# EAGLE design ftdi_modbus_v2 (EAGLE 6.2)
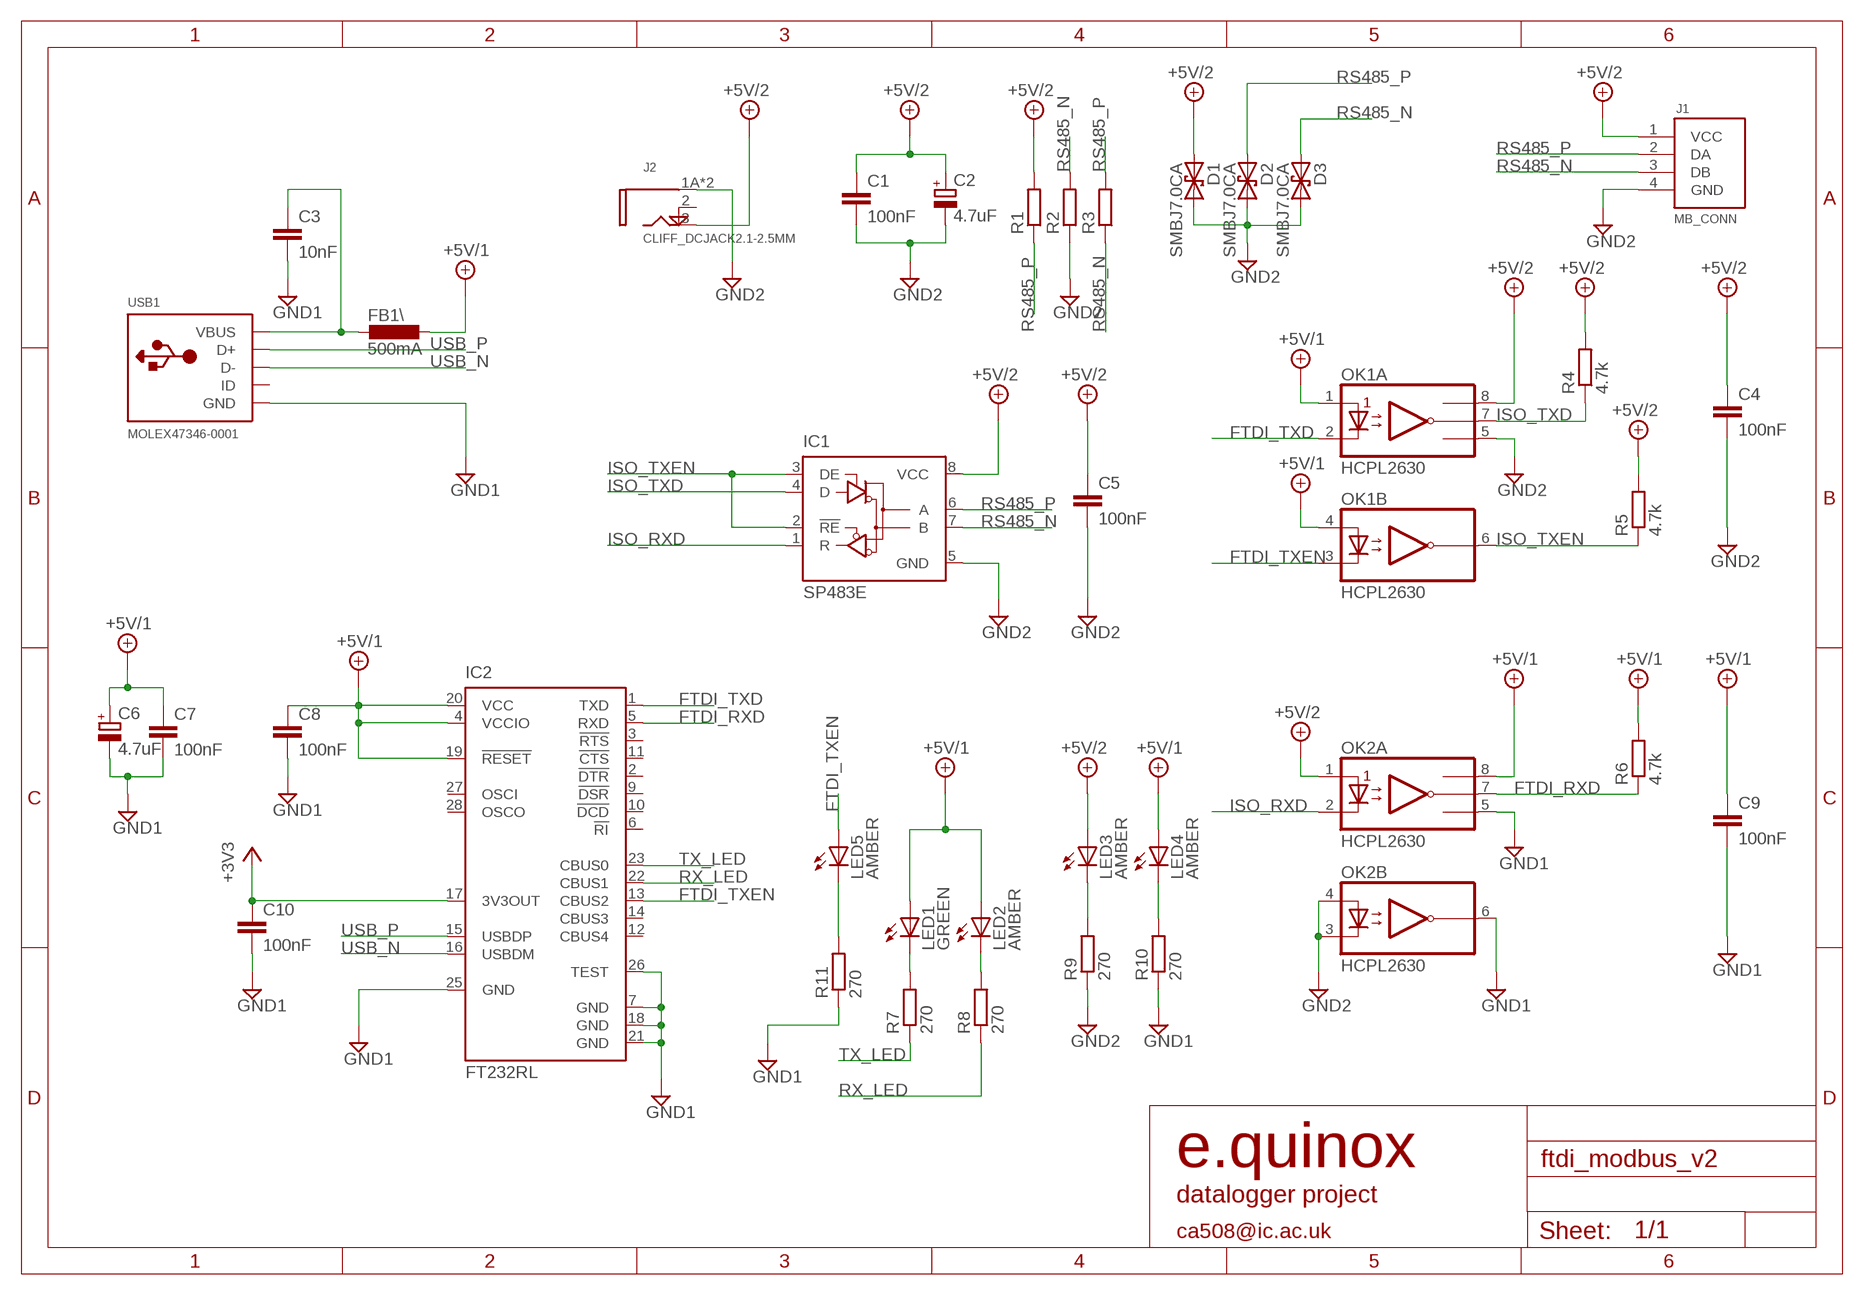
[diagram p0: schematic, sheet 1]

## Parts
C1  100nF  C-EUC0603  [C0603]
C2  4.7uF  CPOL-EUB/3528-21R  [B/3528-21R]
C3  10nF  C-EUC0603  [C0603]
C4  100nF  C-EUC1206  [C1206]
C5  100nF  C-EUC0603  [C0603]
C6  4.7uF  CPOL-EUB/3528-21R  [B/3528-21R]
C7  100nF  C-EUC0603  [C0603]
C8  100nF  C-EUC0603  [C0603]
C9  100nF  C-EUC1206  [C1206]
C10  100nF  C-EUC0603  [C0603]
D1  SMBJ7.0CA  [DO214AA]
D2  SMBJ7.0CA  [DO214AA]
D3  SMBJ7.0CA  [DO214AA]
FB1\  500mA  L-EUL3216C  [L3216C]
IC1  SP483E  75176AD  [D_R-PDSO-G8]
IC2  FT232RL  [SSOP28]
J1  MB_CONN  [PTSM0,5/4-HH-2,5-THR]
J2  CLIFF_DCJACK2.1-2.5MM  [FC6814XS]
LED1  GREEN  LEDCHIPLED_0805  [CHIPLED_0805]
LED2  AMBER  LEDCHIPLED_0805  [CHIPLED_0805]
LED3  AMBER  LEDCHIPLED_0805  [CHIPLED_0805]
LED4  AMBER  LEDCHIPLED_0805  [CHIPLED_0805]
LED5  AMBER  LEDCHIPLED_0805  [CHIPLED_0805]
OK1  HCPL2630  [DIL08]
OK2  HCPL2630  [DIL08]
R1  R-EU_0207/10  [0207/10]
R2  R-EU_0207/10  [0207/10]
R3  R-EU_0207/10  [0207/10]
R4  4.7k  R-EU_M0805  [M0805]
R5  4.7k  R-EU_M0805  [M0805]
R6  4.7k  R-EU_M0805  [M0805]
R7  270  R-EU_M0805  [M0805]
R8  270  R-EU_M0805  [M0805]
R9  270  R-EU_M0805  [M0805]
R10  270  R-EU_M0805  [M0805]
R11  270  R-EU_M0805  [M0805]
USB1  MOLEX47346-0001  [47346-0001]

## Nets
+3V3: C10.1 IC2.17(3V3OUT)
+5V/1: C6.+ C7.1 C8.1 C9.1 FB1\.1 IC2.4(VCCIO) IC2.19(!RESET) IC2.20(VCC) LED1.A LED2.A LED4.A OK1.1(A:A1) OK1.4(B:A2) OK2.8(A:VCC) R6.2
+5V/2: C1.1 C2.+ C4.1 C5.1 D1.P$1 IC1.8(VCC) J1.1(VCC) J2.3(TIP) LED3.A OK1.8(A:VCC) OK2.1(A:A1) R1.2 R4.2 R5.2
FTDI_RXD: IC2.5(RXD) OK2.7(A:VO1) R6.1
FTDI_TXD: IC2.1(TXD) OK1.2(A:C1)
FTDI_TXEN: IC2.13(CBUS2) LED5.A OK1.3(B:C2)
GND1: C3.2 C6.- C7.2 C8.2 C9.2 C10.2 IC2.7(GND) IC2.18(GND) IC2.21(GND) IC2.25(GND) IC2.26(TEST) OK2.5(A:GND) OK2.6(B:VO2) R10.1 R11.1 USB1.5(GND)
GND2: C1.2 C2.- C4.2 C5.2 D1.P$2 D2.P$2 D3.P$2 IC1.5(GND) J1.4(GND) J2.1A(SLEEVE) J2.1B(SLEEVE) OK1.5(A:GND) OK2.3(B:C2) OK2.4(B:A2) R2.1 R9.1
ISO_RXD: IC1.1(R) OK2.2(A:C1)
ISO_TXD: IC1.4(D) OK1.7(A:VO1) R4.1
ISO_TXEN: IC1.2(!RE) IC1.3(DE) OK1.6(B:VO2) R5.1
N$1: C3.1 FB1\.2 USB1.1(VBUS)
N$3: LED1.C R7.2
N$4: LED2.C R8.2
N$7: LED3.C R9.2
N$8: LED4.C R10.2
N$9: LED5.C R11.2
RS485_N: D3.P$1 IC1.7(B) J1.3(DB) R2.2 R3.1
RS485_P: D2.P$1 IC1.6(A) J1.2(DA) R1.1 R3.2
RX_LED: IC2.22(CBUS1) R8.1
TX_LED: IC2.23(CBUS0) R7.1
USB_N: IC2.16(USBDM) USB1.2(D-)
USB_P: IC2.15(USBDP) USB1.3(D+)
Unconnected: IC2.2(!DTR) IC2.3(!RTS) IC2.6(!RI) IC2.9(!DSR) IC2.10(!DCD) IC2.11(!CTS) IC2.12(CBUS4) IC2.14(CBUS3) IC2.27(OSCI) IC2.28(OSCO) USB1.4(ID)

## Notes on the sheet
- e.quinox
- datalogger project
- ca508@ic.ac.uk

## Power pins joined to a net without a drawn wire
SHUNT: J2.2(SHUNT)

## Library data of the parts
C1 C3-C5 C7-C10 = resistor:C-EU: CAPACITOR, European symbol
C2 C6 = resistor:CPOL-EU: POLARIZED CAPACITOR, European symbol
D1-D3 = eko-parts:SMBJ7.0CA
FB1\ = resistor:L-EU: INDUCTOR, European symbol
IC1 = 751xx:75176A: DIFFERENTIAL BUS TRANSCEIVER Source: http://focus.ti.com/lit/ds/symlink/sn75176a.pdf
IC2 = ftdichip:FT232R: Source: http://www.ftdichip.com/Documents/DataSheets/DS_FT232R_v104.pdf; MPN: FT232RL; OC_FARNELL: 1146032; OC_NEWARK: 91K9918
J1 = connectors-pheonix:MB_CONN: Datasheet: Link <http://docs-europe.electrocomponents.com/webdocs/0ecc/0900766b80ecc30f.pdf> RS Stock No:712-4500 <http://uk.rs-online.com/web/p/terminal-blocks/7124500/> Mfr Part: PTSM 0,5/ 4-HH-2,5-THR
J2 = minibox-parts:CLIFF_DCJACK
LED1-LED5 = led:LED: LED OSRAM: - CHIPLED LG R971, LG N971, LY N971, LG Q971, LY Q971, LO R971, LY R971 LH N974, LH R974 LS Q976, LO Q976, LY Q976 LO Q996 - Hyper CHIPLED LW Q18S LB Q993, LB Q99A, LB R99A - SideLED LS A670, LO A670, LY A670, LG A670, LP A670 LB A673, LV A673, LT A673, LW A673 LH A674 LY A675 LS A676, LA A676, LO A676, LY A676, LW A676 LS A679, LY A679, LG A679 - Hyper Micro SIDELED® LS Y876, LA Y876, LO Y876, LY Y876 LT Y87S - SmartLED LW L88C, LW L88S LB L89C, LB L89S, LG L890 LS L89K, LO L89K, LY L89K LS L896, LA L896, LO L896, LY L896 - TOPLED LS T670, LO T670, LY T670, LG T670, LP T670 LSG T670, LSP T670, LSY T670, LOP T670, LYG T670 LG T671, LOG T671, LSG T671 LB T673, LV T673, LT T673, LW T673 LH T674 LS T676, LA T676, LO T676, LY T676, LB T676, LH T676, LSB T676, LW T676 LB T67C, LV T67C, LT T67C, LS T67K, LO T67K, LY T67K, LW E67C LS E67B, LA E67B, LO E67B, LY E67B, LB E67C, LV E67C, LT E67C LW T67C LS T679, LY T679, LG T679 LS T770, LO T770, LY T770, LG T770, LP T770 LB T773, LV T773, LT T773, LW T773 LH T774 LS E675, LA E675, LY E675, LS T675 LS T776, LA T776, LO T776, LY T776, LB T776 LHGB T686 LT T68C, LB T68C - Hyper Mini TOPLED® LB M676 - Mini TOPLED Santana® LG M470 LS M47K, LO M47K, LY M47K Source: http://www.osram.convergy.de LUXEON: - LUMILED® LXK2-PW12-R00, LXK2-PW12-S00, LXK2-PW14-U00, LXK2-PW14-V00 LXK2-PM12-R00, LXK2-PM12-S00, LXK2-PM14-U00 LXK2-PE12-Q00, LXK2-PE12-R00, LXK2-PE12-S00, LXK2-PE14-T00, LXK2-PE14-U00 LXK2-PB12-K00, LXK2-PB12-L00, LXK2-PB12-M00, LXK2-PB14-N00, LXK2-PB14-P00, LXK2-PB14-Q00 LXK2-PR12-L00, LXK2-PR12-M00, LXK2-PR14-Q00, LXK2-PR14-R00 LXK2-PD12-Q00, LXK2-PD12-R00, LXK2-PD12-S00 LXK2-PH12-R00, LXK2-PH12-S00 LXK2-PL12-P00, LXK2-PL12-Q00, LXK2-PL12-R00 Source: www.luxeon.com KINGBRIGHT: KA-3528ASYC Source: www.kingbright.com
OK1 OK2 = optocoupler:HCPL2630: HEWLETT PACKARD OPTO COUPLER; MF: AGILENT TECHNOLOGIES; MPN: HCPL-2630-000E; OC_FARNELL: 9994904; OC_NEWARK: 88H7813
R1-R11 = resistor:R-EU_: RESISTOR, European symbol
USB1 = connectors-usb-ca508fyp:MOLEX47346-0001: USB Micro B http://onecall.farnell.com/jsp/search/browse.jsp;jsessionid=IUXOLF3HYHDEGCQLCIPJOXQ?N=411&Ntk=gensearch&Ntt=47346-0001&Ntx=mode+matchallpartial&exposeLevel2Refinement=true&suggestions=false&ref=globalsearch&_requestid=528981

## Board
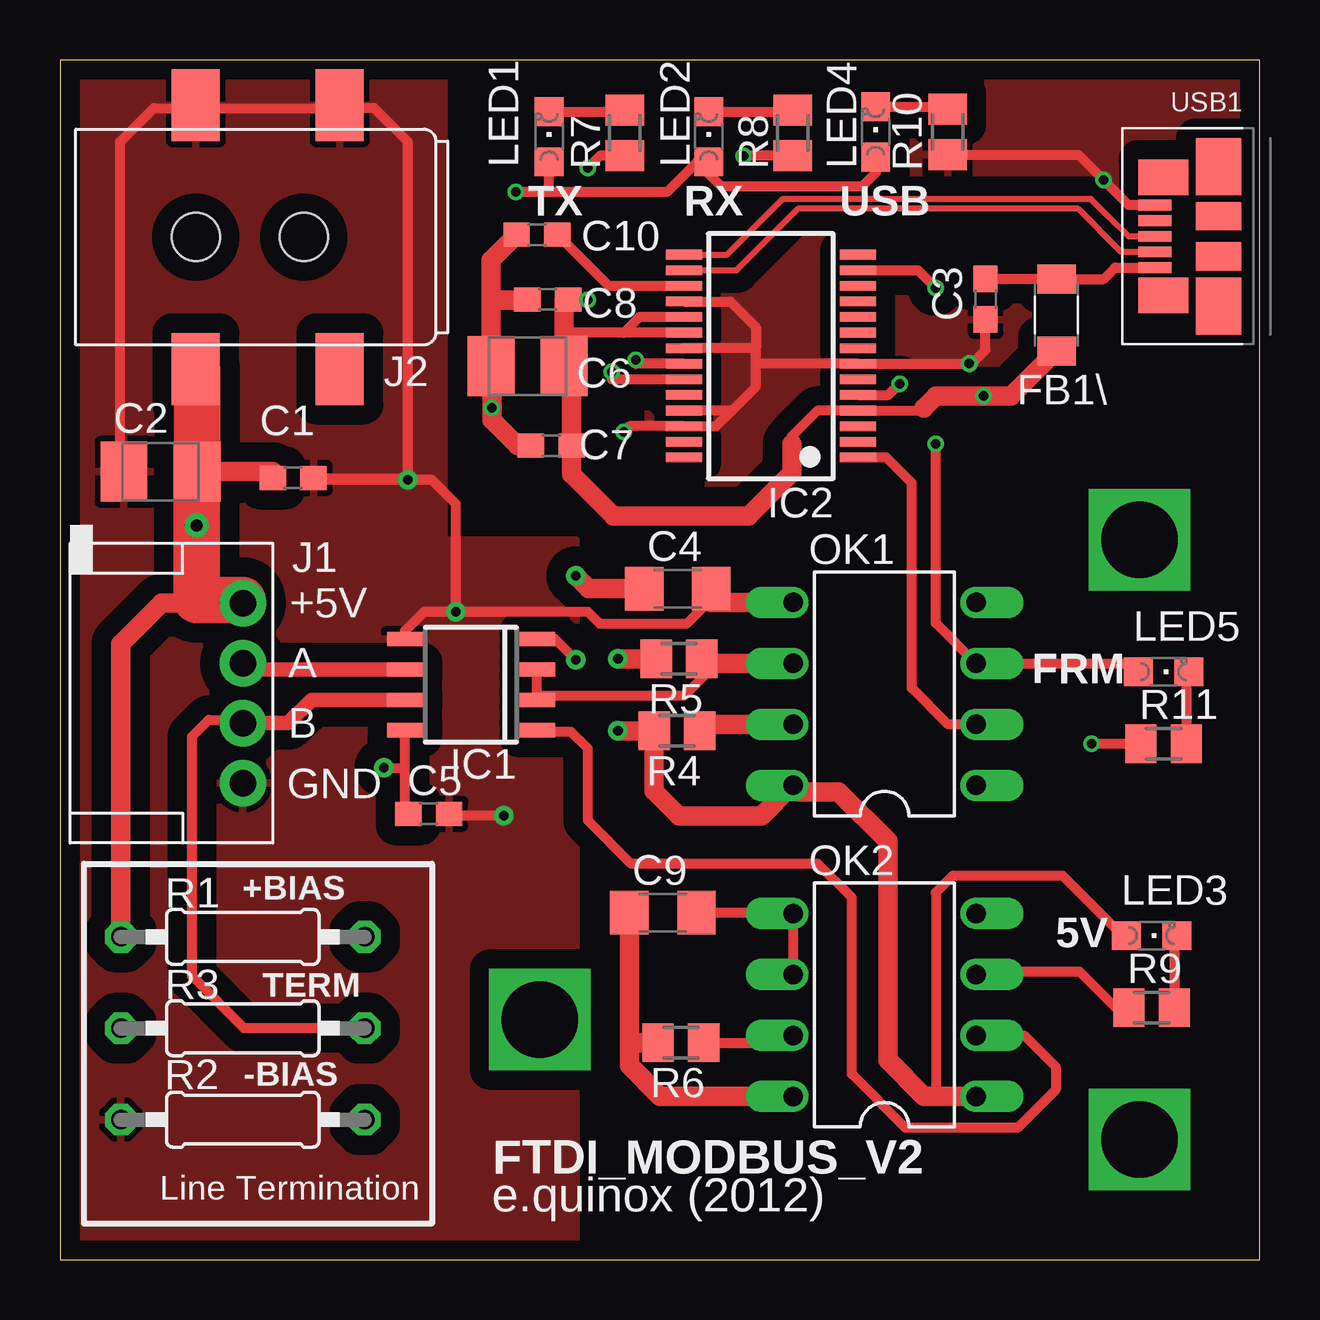
[diagram p1: board, top side]
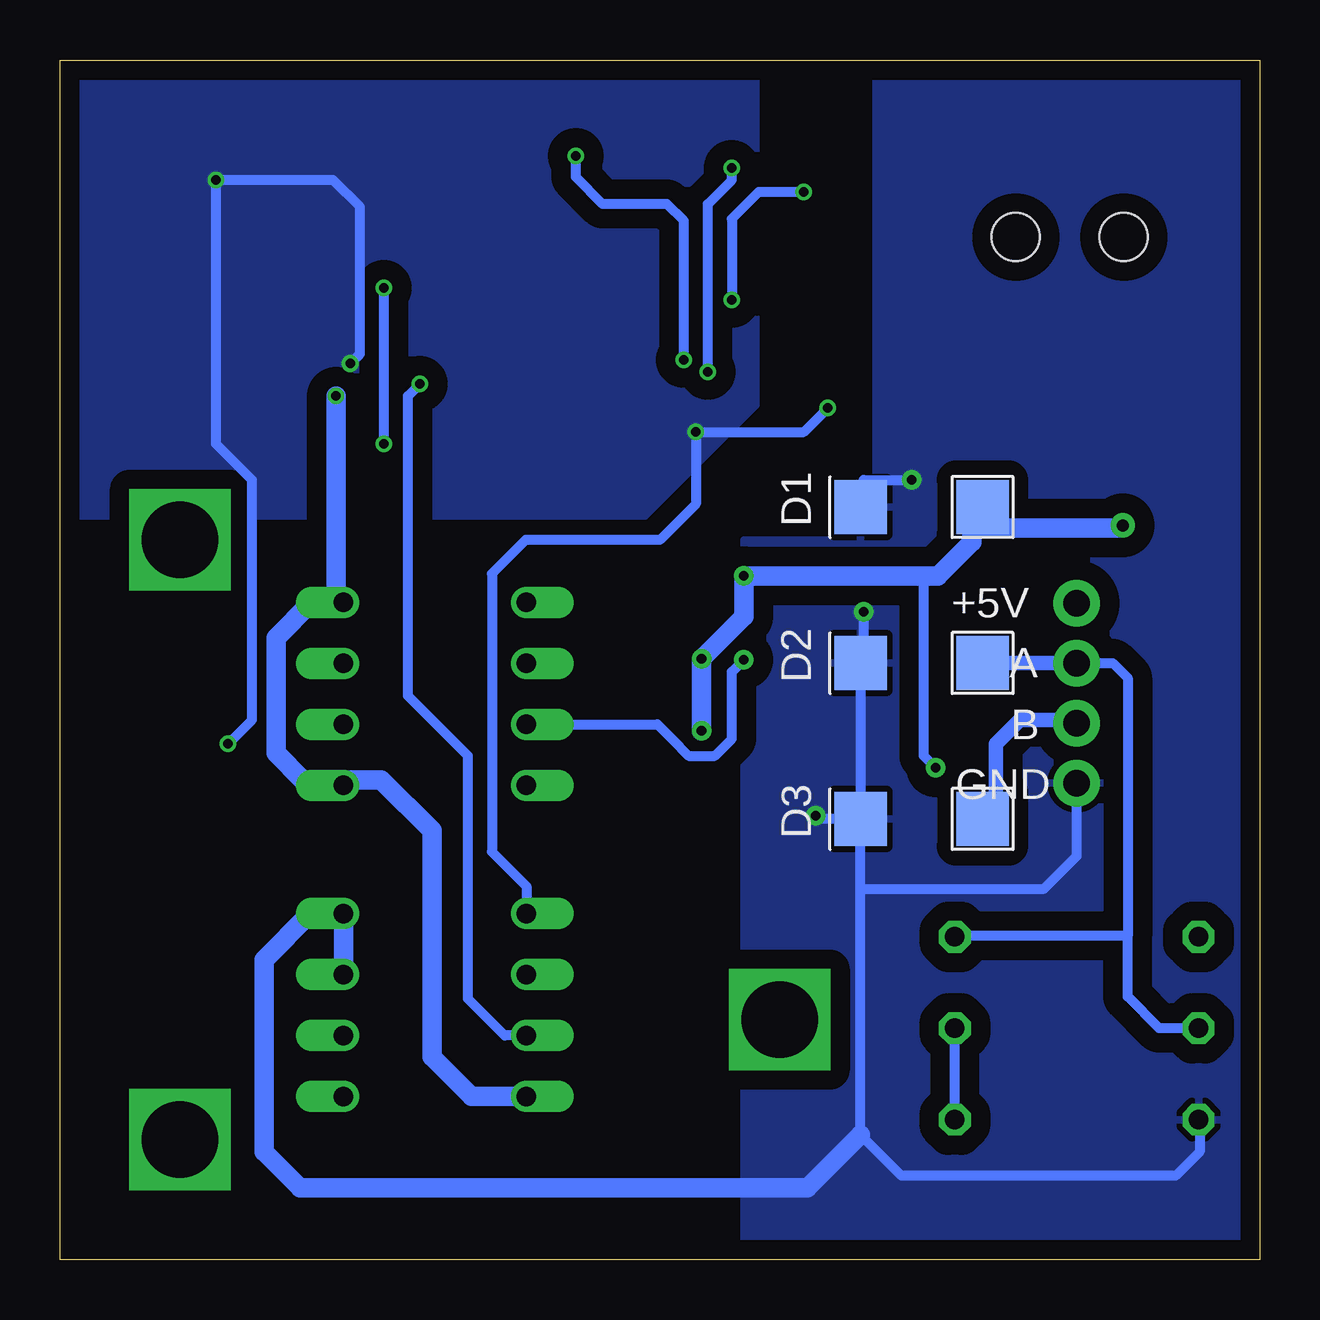
[diagram p2: board, bottom side, seen from below]

Size 50 x 50 mm. Coordinates in mm from the lower left corner, seen from the top.
Outline: 0,0 50,0 50,50 0,50 0,0
Copper layers (1*16): Top 0.035mm / dielectric 1.5mm / Bottom 0.035mm
Design rules: minimum track width 6mil, minimum drill 12mil, track to track 6mil, track to pad 6mil, pad to pad 6mil, via to via 6mil, smd to smd 0mil, copper to edge 10mil, drill to drill 10mil, minimum pad ring 10mil, minimum via ring 6mil, stop-mask expansion 2mil, vias tented up to drill 100mil, thermal gap 10mil

### Footprints (pad centres in the part's own frame; a part is rotated, then mirrored left to right if it is on the bottom)
C0603 = smd 1.1 x 1: 1 -0.85,0; 2 0.85,0
B/3528-21R = smd 1.95 x 2.5: + 1.525,0; - -1.525,0
C1206 = smd 1.6 x 1.8: 1 -1.4,0; 2 1.4,0
DO214AA = smd 2.184 x 2.261: P$1 -2.54,0; P$2 2.54,0
L3216C = smd 1.2 x 1.6: 1 -1.5,0; 2 1.5,0
D_R-PDSO-G8 = smd 0.6 x 1.5: 1 -1.905,-2.75; 2 -0.635,-2.75; 3 0.635,-2.75; 4 1.905,-2.75; 5 1.905,2.75; 6 0.635,2.75; 7 -0.635,2.75; 8 -1.905,2.75
SSOP28 = smd 0.4 x 1.5: 1 -4.225,-3.625; 2 -3.575,-3.625; 3 -2.925,-3.625; 4 -2.275,-3.625; 5 -1.625,-3.625; 6 -0.975,-3.625; 7 -0.325,-3.625; 8 0.325,-3.625; 9 0.975,-3.625; 10 1.625,-3.625; 11 2.275,-3.625; 12 2.925,-3.625; 13 3.575,-3.625; 14 4.225,-3.625; 15 4.225,3.625; 16 3.575,3.625; 17 2.925,3.625; 18 2.275,3.625; 19 1.625,3.625; 20 0.975,3.625; 21 0.325,3.625; 22 -0.325,3.625; 23 -0.975,3.625; 24 -1.625,3.625; 25 -2.275,3.625; 26 -2.925,3.625; 27 -3.575,3.625; 28 -4.225,3.625
PTSM0,5/4-HH-2,5-THR = drill 1.1 pad 1.93: 1 -3.75,0; 2 -1.25,0; 3 1.25,0; 4 3.75,0
FC6814XS = smd 3 x 2: 1A -5.5,-4.5; 1B -5.5,1.5; 2 5.5,1.5; 3 5.5,-4.5 | hole 2: 0,0; 0,-4.5
CHIPLED_0805 = smd 1.2 x 1.2: A 0,-1.05; C 0,1.05
DIL08 = drill 0.813 offset: 1 -3.81,-3.81; 2 -1.27,-3.81; 3 1.27,-3.81; 4 3.81,-3.81; 5 3.81,3.81; 6 1.27,3.81; 7 -1.27,3.81; 8 -3.81,3.81
0207/10 = drill 0.813 octagon: 1 -5.08,0; 2 5.08,0
M0805 = smd 1.3 x 1.6: 1 -0.95,0; 2 0.95,0
47346-0001 = smd 1.38 x 0.45: 1 2.66,1.3; 2 2.66,0.65; 3 2.66,0; 4 2.66,-0.65; 5 2.66,-1.3 | smd 1.9 x 2.375: SHIELD-1 0,2.913; SHIELD-4 0,-2.913 | smd 1.9 x 1.175: SHIELD-2 0,0.838; SHIELD-3 0,-0.838 | smd 2.1 x 1.475: SHIELD-6 2.3,2.462; SHIELD-7 2.3,-2.462

### Placement (x,y rotation side)
C1  9.72,32.58 0 top
C2  4.19,32.84 0 top
C3  38.58,40.03 270 top
C4  25.75,27.96 0 top
C5  15.37,18.58 0 top
C6  19.49,37.23 0 top
C7  20.48,33.92 180 top
C8  20.33,40.02 180 top
C9  25.13,14.46 0 top
C10  19.88,42.72 180 top
D1  14.09,31.36 180 bottom
D2  14.09,24.86 180 bottom
D3  14.09,18.36 180 bottom
FB1\  41.54,39.37 90 top
IC1  17.13,23.96 90 top
IC2  29.63,37.66 90 top
J1  7.62,23.61 270 top
J2  10.16,42.62 270 top
LED1  20.39,46.8 0 top
LED2  27.04,46.8 0 top
LED3  45.5,13.5 270 top
LED4  34,47 0 top
LED5  46,24.5 270 top
OK1  34.37,23.58 90 top
OK2  34.37,10.61 90 top
R1  7.62,13.45 180 top
R2  7.62,5.83 0 top
R3  7.62,9.64 180 top
R4  25.72,22.04 180 top
R5  25.8,25.04 180 top
R6  25.88,9.04 180 top
R7  23.54,46.96 90 top
R8  30.54,46.96 90 top
R9  45.5,10.5 0 top
R10  37,47 90 top
R11  46,21.5 0 top
USB1  48.29,42.65 180 top

### Tracks (layer width: path | path; a pad name or v marks a point on that pad's centre or on a via)
+3V3
  Top 0.406: C10.1 22.86,40.59 IC2.17
+5V/1  (via drill 0.4 pad 0.61)
  Top 0.406: IC2.20 23.5,38.63 | 23.5,38.63 21.02,38.63 21.02,38.5 | IC2.19 24.15,39.28 23.5,38.63 | 36,35.5 36,35.38 IC2.4 31.57,35.38 30.5,34.31 30.5,34 | 20.39,44.5 25.29,44.5 26.54,45.75 LED2.A 27.04,45.26 27.58,44.72 33.43,44.72 34,45.29 LED4.A | 20.39,44.5 LED1.A | 21.02,40.02 22,40.02 v22,40 | 20.39,44.5 v19,44.5
  Top 0.813: FB1\.1 41.5,37.87 39.63,36 v38.5,36 36.5,36 36,35.5 | C8.1 21.02,40.02 21.02,38.5 C6.+ 21.33,37.23 C7.1 21.33,32.74 23.07,31 28.7,31 30.5,32.8 30.5,34 | R6.2 23.73,9.04 | 23.73,9.04 C9.1 | OK2.8 25.02,6.8 23.73,8.09 23.73,9.04
  Bottom 0.406: v19,44.5 20.88,44.5 22,43.38 v22,40
  Bottom 0.813: OK2.8 32.84,6.8 34.5,8.46 34.5,17.88 36.62,20 37.95,20 | 37.95,20 OK1.1 | 37.95,20 39.88,20 41,21.12 41,25.91 39.52,27.39 OK1.4 38.5,27.39 v38.5,36
+5V/2  (via drill 0.4 pad 0.81, 0.5 pad 1.02)
  Top 0.406: C5.1 14.38,18.58 14.38,20.5 | 14.38,20.5 IC1.8 | v13.5,20.5 14.38,20.5 | LED3.A 44.29,13.5 41.79,16 37.21,16 36.5,15.29 36.5,6.8
  Top 0.813: J1.1 4.23,27.36 2.54,25.67 R1.2 | C2.+ 8.87,32.84 C1.1 | OK2.1 36.5,6.8 36.01,6.8 34.5,8.31 34.5,17.44 32.44,19.5 30.83,19.5 OK1.8 30.46,19.73 29.23,18.5 25.8,18.5 24.77,19.53 R4.2 v23.26,22.04 | R5.2 v23.26,25.04 | C4.1 22.04,27.96 v21.5,28.5
  Top 1.93: J2.3 5.71,37.12 C2.+ v5.7,30.6 5.7,27.5 7.62,27.5 J1.1
  Bottom 0.406: v13.5,20.5 14,21 14,28.5
  Bottom 0.813: v5.7,30.6 5.7,30.5 11.5,30.5 11.5,31.36 D1.P$1 12,31.36 12,29.91 13.41,28.5 14,28.5 v21.5,28.5 21.5,26.8 v23.26,25.04 v23.26,22.04
FTDI_RXD  (via drill 0.4 pad 0.61)
  Top 0.406: R6.1 30.26,9.04 OK2.7 | IC2.5 34.53,36.03 v35,36.5
  Bottom 0.406: OK2.7 31.47,9.34 33,10.87 33,21 35,23 35.5,23.5 35.5,36 v35,36.5
FTDI_TXD
  Top 0.406: OK1.2 37.01,22.31 35.5,23.82 35.5,32.38 34.44,33.44 IC2.1
FTDI_TXEN  (via drill 0.4 pad 0.61)
  Top 0.406: v36.5,34 36.5,26.53 OK1.3 44.95,24.85 LED5.A | IC2.13 35.77,41.23 v36.5,40.5
  Bottom 0.406: v36.5,34 v36.5,40.5
GND1  (via drill 0.4 pad 0.61)
  Top 0.406: C9.2 30.56,14.46 OK2.5 OK2.6 | 29,37.34 IC2.7 38,37.34 | 29,37.34 29,38 | 29,38 26,38 IC2.21 | 28,35.39 27.34,34.73 IC2.26 23.73,34.73 v23.5,34.5 | 28,35.39 IC2.25 | 28,35.39 29,36.39 29,37.34 | IC2.18 27.94,39.94 29,38.88 29,38 | 38,37.34 38.58,37.91 C3.2 | v37.9,37.35 38,37.35 38,37.34 | USB1.5 44.55,43.95 v43.5,45 42.45,46.05 R10.1 | R11.1 v43,21.5
  Top 0.813: C10.2 17.96,41.66 17.96,40 | 17.96,40 C6.- 18,37.2 v18,35.5 18,35 19.08,33.92 C7.2 | C8.2 19.46,40 17.96,40
  Bottom 0.406: v37.9,37.35 37.5,37.75 37.5,43.88 38.62,45 v43.5,45 43.5,34 42,32.5 42,22.5 v43,21.5 | v18,35.5 19,34.5 v23.5,34.5 23.5,31.5 25,30 30.59,30 32,28.59 32,17 30.56,15.56 OK2.5
  pour Bottom (isolate 0.813): 50,50 21,50 21,35.61 25.61,31 50,31
  pour Top (isolate 0.813): 50,50 24.5,50 24.5,31 50,31
GND2  (via drill 0.4 pad 0.81)
  Top 0.406: 27.15,27.39 27,27.39 26.11,26.5 22.5,26.5 22,27 v16.5,27 | v16.5,27 15.18,27 14.38,26.2 IC1.5 | v18.5,18.5 16.22,18.5 C5.2 | v16.5,27 16.5,31.5 15.5,32.5 v14.5,32.5 10.57,32.5 C1.2 14.5,32.58 14.5,46.59 13.09,48 11.66,48 | C2.- 2.5,32.84 2.5,46.59 3.91,48 5.66,48 | 5.66,48 J2.1A | 5.66,48 11.66,48 | 11.66,48 J2.1B | R9.1 44,10.5 42.5,12 38.18,12 OK2.3
  Top 0.813: OK1.5 27.15,27.39 C4.2
  Bottom 0.406: R2.1 2.5,5.83 2.5,4.5 3.5,3.5 14.93,3.5 16.63,5.21 16.63,15.45 | 16.63,15.45 D3.P$2 | D3.P$2 18.5,18.36 v18.5,18.5 | D3.P$2 D2.P$2 16.5,24.86 v16.5,27 | 16.63,15.45 8.99,15.45 7.62,16.82 J1.4 | D1.P$2 16.5,31.36 16.5,32.5 v14.5,32.5
  Bottom 0.813: OK2.3 OK2.4 39.58,14.42 41.5,12.5 41.5,4.5 40,3 18.84,3 16.63,5.21
  pour Top (isolate 0.813): 0,50 16,50 16,30 21.5,30 21.5,0 0,0
  pour Bottom (isolate 0.813): 0,50 16,50 16,30 21.5,30 21.5,0 0,0
ISO_RXD
  Top 0.406: 20,22.05 IC1.1 19.88,22 21.29,22 22,21.29 22,18.3 23.8,16.5 31.59,16.5 33,15.09 33,7.74 35.24,5.5 39.92,5.5 41.5,7.08 41.5,8.03 40.19,9.34 OK2.2
ISO_TXD  (via drill 0.4 pad 0.81)
  Top 0.406: IC1.4 20.64,25.86 v21.5,25
  Top 0.813: OK1.7 26.67,22.31 R4.1
  Bottom 0.406: OK1.7 25.1,22.31 24.5,21.71 23.79,21 22.71,21 22,21.71 22,24.5 v21.5,25
ISO_TXEN
  Top 0.406: IC1.3 IC1.2 19.88,23.5 26,23.5 27,24.5 27,25.04 R5.1
  Top 0.813: OK1.6 27.25,24.85 R5.1
N$1
  Top 0.406: C3.1 FB1\.2 43.5,40.87 43.98,41.35 USB1.1
N$2  (via drill 3.2 pad 3.81)
  other vias: 45,30
N$3
  Top 0.406: LED1.C 23.54,47.85 R7.2
N$4
  Top 0.406: LED2.C 30.54,47.85 R8.2
N$5  (via drill 3.2 pad 3.81)
  other vias: 45,5
N$6  (via drill 3.2 pad 3.81)
  other vias: 20,10
N$7
  Top 0.406: LED3.C 46.45,13.5 R9.2
N$8
  Top 0.406: LED4.C 37,48.05 R10.2
N$9
  Top 0.406: LED5.C 46.95,24.5 R11.2
RS485_N
  Top 0.406: R3.1 7.68,9.64 5.5,11.82 5.5,21.79 6.21,22.5 7.62,22.5 J1.3
  Top 0.61: IC1.7 10.48,23.32 9.52,22.36 J1.3
  Bottom 0.406: R2.2 R3.1
  Bottom 0.61: D3.P$1 11,18.36 11,21.5 10,22.5 7.62,22.5 J1.3
RS485_P
  Top 0.61: IC1.6 7.88,24.59 J1.2
  Bottom 0.406: J1.2 6.12,24.86 5.5,24.24 5.5,13.5 | 5.5,13.5 12.7,13.5 R1.1 | R3.2 4.18,9.64 5.5,10.96 5.5,13.5
  Bottom 0.61: D2.P$1 J1.2
RX_LED  (via drill 0.4 pad 0.61)
  Top 0.406: IC2.22 24,37.34 v24,37.5 | R8.1 v28.5,46.01 v28.5,46
  Bottom 0.406: v24,37.5 24,43.29 24.71,44 27.38,44 28.5,45.12 v28.5,46
TX_LED  (via drill 0.4 pad 0.61)
  Top 0.406: IC2.23 23,36.69 v23,37 | R7.1 22.51,46.01 v22,45.5
  Bottom 0.406: v23,37 23,44 22,45 v22,45.5
USB_N
  Top 0.254: IC2.16 28.2,41.23 30.77,43.8 42.45,43.8 44.24,42 USB1.2
USB_P
  Top 0.254: IC2.15 27.8,41.88 30.11,44.2 42.97,44.2 43.7,43.47 44.53,42.65 USB1.3

### Text on the board
tNames: TX | RX | USB | +5V | A | FRM | B | GND | +BIAS | 5V | TERM | -BIAS | FTDI_MODBUS_V2 | Line Termination | e.quinox (2012)
bNames: +5V | A | B | GND